# EAGLE design MotorDriverSchem (EAGLE 9.5.2)
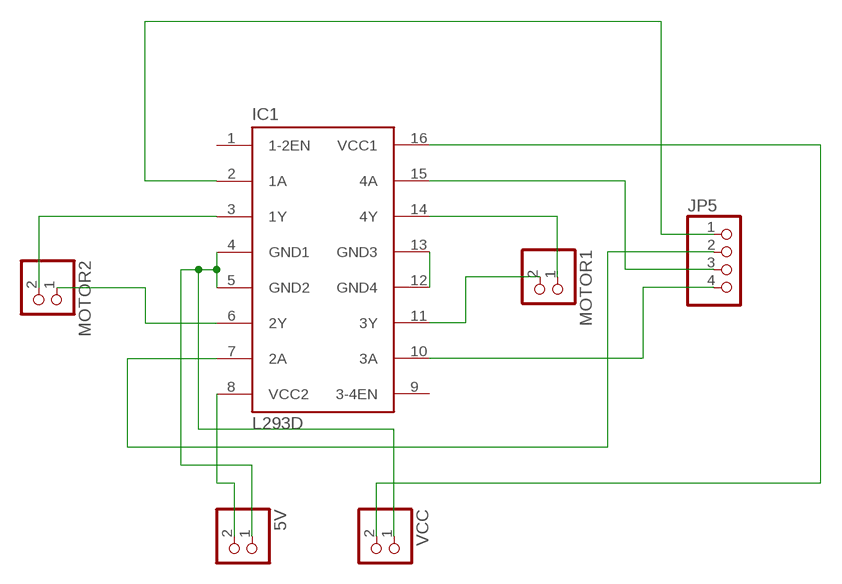
[diagram p0: schematic, sheet 1]

## Parts
5V  PINHD-1X2  [1X02]
IC1  L293D  [DIL16]
JP5  PINHD-1X4  [1X04]
MOTOR1  PINHD-1X2  [1X02]
MOTOR2  PINHD-1X2  [1X02]
VCC  PINHD-1X2  [1X02]

## Nets
N$1: IC1.3(1Y) MOTOR2.2
N$2: IC1.6(2Y) MOTOR2.1
N$3: IC1.14(4Y) MOTOR1.1
N$4: IC1.11(3Y) MOTOR1.2
N$5: 5V.1 IC1.4(GND1) IC1.5(GND2) VCC.1
N$6: IC1.12(GND4) IC1.13(GND3)
N$7: IC1.2(1A) JP5.1
N$8: IC1.7(2A) JP5.2
N$9: IC1.15(4A) JP5.3
N$10: IC1.10(3A) JP5.4
N$11: 5V.2 IC1.8(VCC2)
N$12: IC1.16(VCC1) VCC.2
Unconnected: IC1.1(1-2EN) IC1.9(3-4EN)

## Library data of the parts
5V MOTOR1 MOTOR2 VCC = pinhead:PINHD-1X2: PIN HEADER
IC1 = st-microelectronics:L293D: PUSH-PULL 4 CHANNEL DRIVER; MPN: L293D; OC_FARNELL: 9589619; OC_NEWARK: 56P8249
JP5 = pinhead:PINHD-1X4: PIN HEADER

## Board
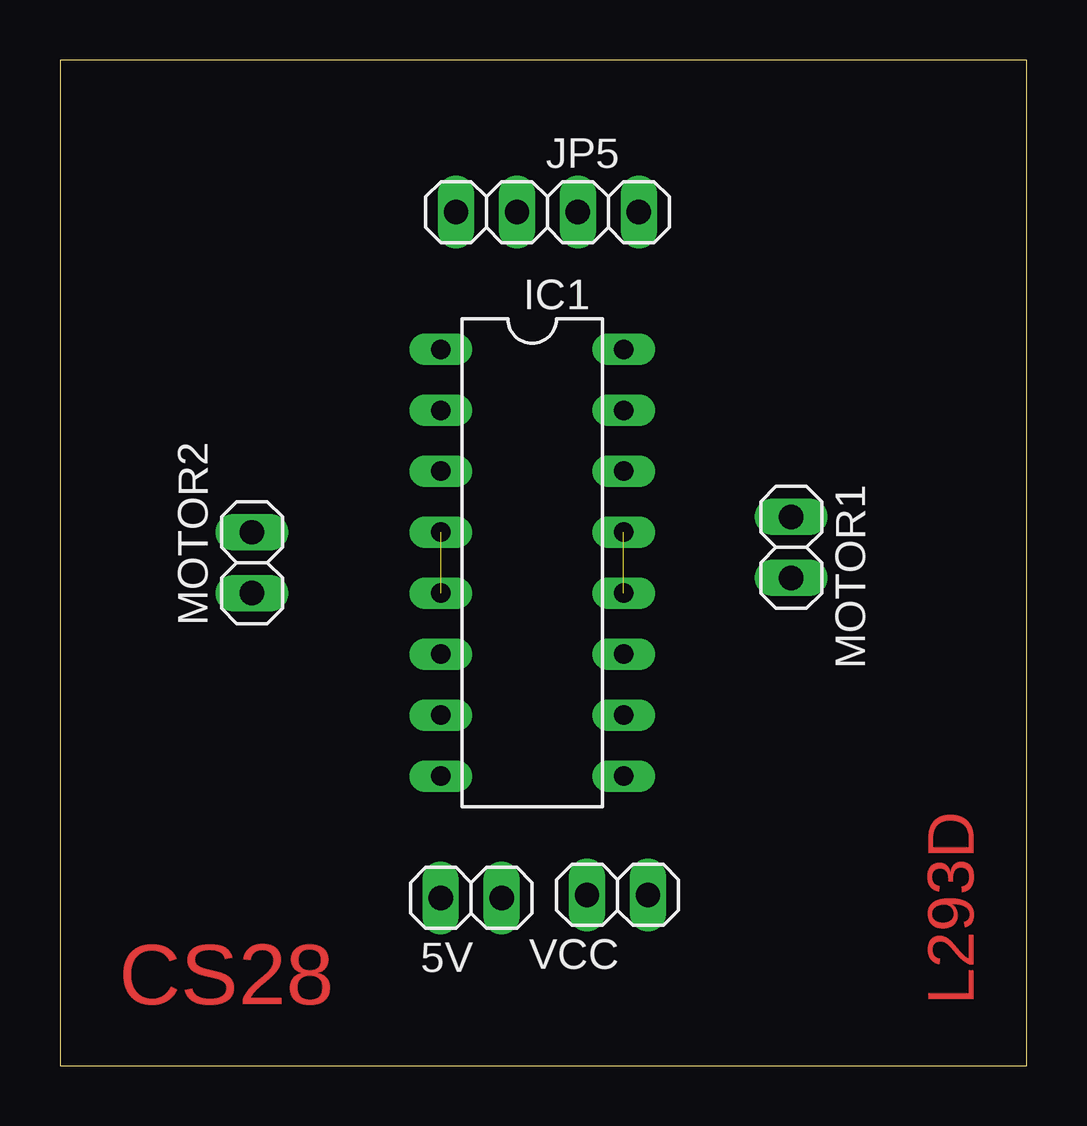
[diagram p1: board, top side]
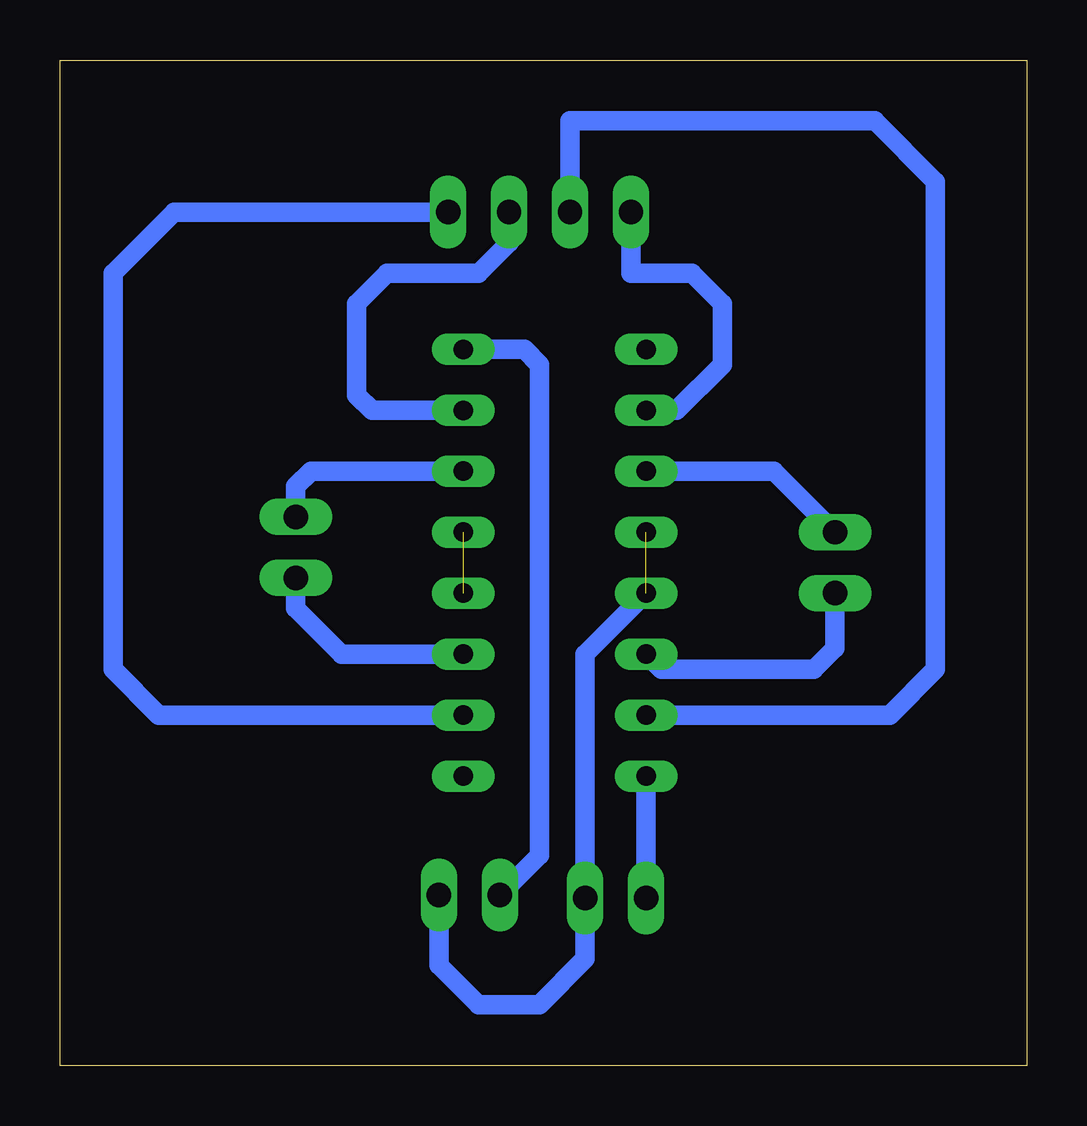
[diagram p2: board, bottom side, seen from below]

Size 40.31 x 41.9 mm. Coordinates in mm from the lower left corner, seen from the top.
Outline: 0,0 40.31,0 40.31,41.9 0,41.9 0,0
Copper layers (1*16): Top 0.035mm / dielectric 1.5mm / Bottom 0.035mm
Design rules "default": minimum track width 6mil, minimum drill 0.35mm, track to track 6mil, track to pad 6mil, pad to pad 6mil, via to via 6mil, smd to smd 6mil, copper to edge 40mil, drill to drill 6mil, minimum pad ring 10mil, minimum via ring 8mil, stop-mask expansion 4mil, vias tented up to drill 0mil, thermal gap 10mil

### Footprints (pad centres in the part's own frame; a part is rotated, then mirrored left to right if it is on the bottom)
1X02 = drill 1.016 long: 1 -1.27,0; 2 1.27,0
DIL16 = drill 0.813 long: 1 -8.89,-3.81; 2 -6.35,-3.81; 3 -3.81,-3.81; 4 -1.27,-3.81; 5 1.27,-3.81; 6 3.81,-3.81; 7 6.35,-3.81; 8 8.89,-3.81; 9 8.89,3.81; 10 6.35,3.81; 11 3.81,3.81; 12 1.27,3.81; 13 -1.27,3.81; 14 -3.81,3.81; 15 -6.35,3.81; 16 -8.89,3.81
1X04 = drill 1.016 long: 1 -3.81,0; 2 -1.27,0; 3 1.27,0; 4 3.81,0

### Placement (x,y rotation side)
5V  17.14,6.98 180 top
IC1  19.69,20.96 270 top
JP5  20.32,35.56 0 top
MOTOR1  30.48,21.59 270 top
MOTOR2  8,20.96 90 top
VCC  23.24,7.11 180 top

### Tracks (layer width: path | path; a pad name or v marks a point on that pad's centre or on a via)
N$1
  Bottom 0.813: IC1.3 10.54,24.76 MOTOR2.2
N$2
  Bottom 0.813: MOTOR2.1 8,17.4 8.89,16.51 15.24,16.51 IC1.6
N$3
  Bottom 0.813: IC1.14 29.84,24.76 30.48,24.13 MOTOR1.1
N$4
  Bottom 0.813: MOTOR1.2 30.48,19.05 28.57,17.14 IC1.11
N$5  (1 unrouted)
  Bottom 0.813: IC1.5 18.41,17.14 5V.1 18.41,4.45 20.32,2.54 22.86,2.54 24.51,4.19 VCC.1
N$6  (1 unrouted)
N$7
  Bottom 0.813: JP5.1 16.51,33.02 13.97,33.02 12.7,31.75 12.7,29.21 14.6,27.31 IC1.2
N$8
  Bottom 0.813: JP5.2 19.05,39.37 6.35,39.37 3.81,36.83 3.81,16.51 5.71,14.61 IC1.7
N$9
  Bottom 0.813: JP5.3 21.59,34.29 22.86,33.02 26.67,33.02 27.94,31.75 27.94,27.94 27.3,27.31 IC1.15
N$10
  Bottom 0.813: IC1.10 36.2,14.61 38.1,16.51 38.1,33.02 35.56,35.56 JP5.4
N$11
  Bottom 0.813: 5V.2 IC1.8
N$12
  Bottom 0.813: VCC.2 20.32,8.76 20.32,29.21 20.95,29.85 IC1.16

### Text on the board
Top: CS28 | L293D